# Altium schematic sheet Page-2.schdoc: CONNECTION
size 298 x 207 mm; CompanyName: InSYS; DrawnBy: NaveenKumar; Revision: 2.0; SheetNumber: 2; SheetTotal: 10; Title2: Gateway
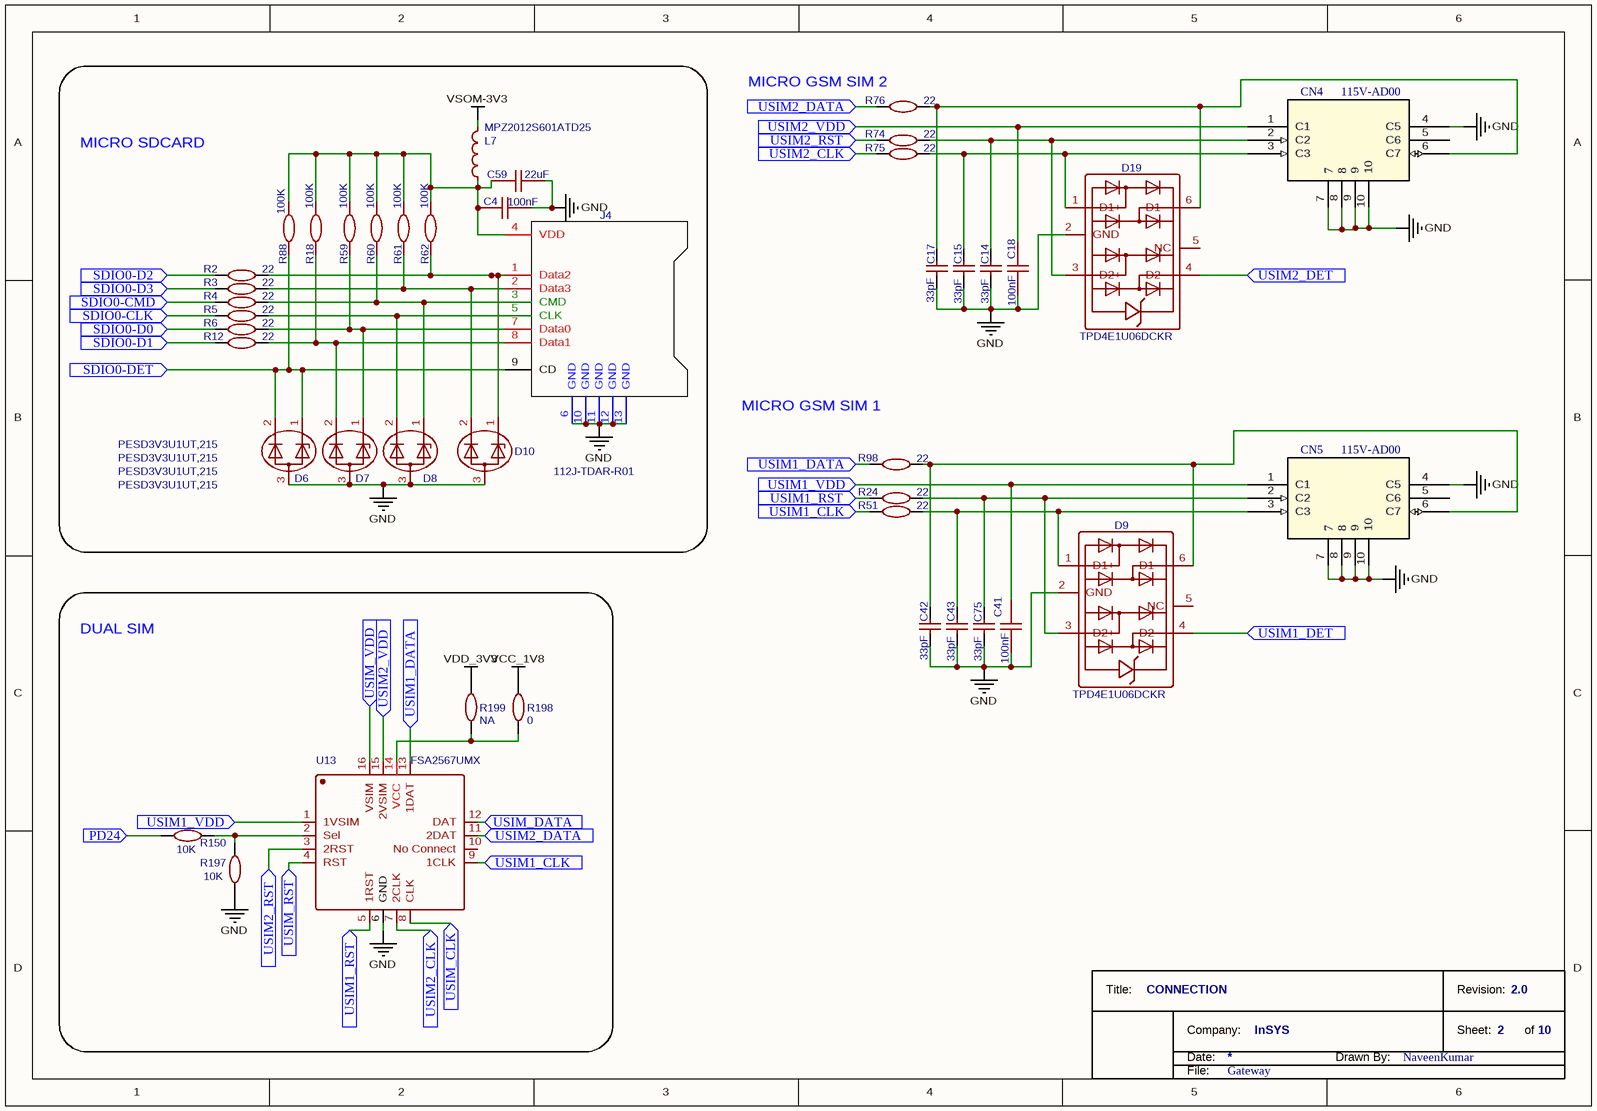
[diagram p0: Page-2.schdoc]

## Parts
*  TitleBlock_1  (value not drawn)  (graphical)
C4  100nF  [GWAY_Capacitor_0603]
C14  33pF  [GWAY_Capacitor_0603]
C15  33pF  [GWAY_Capacitor_0603]
C17  33pF  [GWAY_Capacitor_0603]
C18  100nF  [GWAY_Capacitor_0603]
C41  100nF  [GWAY_Capacitor_0603]
C42  33pF  [GWAY_Capacitor_0603]
C43  33pF  [GWAY_Capacitor_0603]
C59  22uF  [GWAY_Capacitor_0805]
C75  33pF  [GWAY_Capacitor_0603]
CN4  115V-AD00  [GWAY_115V-AD00_ATT]
CN5  115V-AD00  [GWAY_115V-AD00_ATT]
D6  PESD3V3U1UT,215  [GWAY_SOT23-3PIN]
D7  PESD3V3U1UT,215  [GWAY_SOT23-3PIN]
D8  PESD3V3U1UT,215  [GWAY_SOT23-3PIN]
D9  TPD4E1U06DCKR  [GWAY_SC70-6PIN]
D10  PESD3V3U1UT,215  [GWAY_SOT23-3PIN]
D19  TPD4E1U06DCKR  [GWAY_SC70-6PIN]
J4  112J-TDAR-R01  [GWAY_12JTDARR01]
L7  MPZ2012S601ATD25  [GWAY_FerriteeBEAD_0805_C2012X105N]
R2  22  [GWAY_Resistor_0603]
R3  22  [GWAY_Resistor_0603]
R4  22  [GWAY_Resistor_0603]
R5  22  [GWAY_Resistor_0603]
R6  22  [GWAY_Resistor_0603]
R12  22  [GWAY_Resistor_0603]
R18  100K  [GWAY_Resistor_0603]
R24  22  [GWAY_Resistor_0603]
R51  22  [GWAY_Resistor_0603]
R59  100K  [GWAY_Resistor_0603]
R60  100K  [GWAY_Resistor_0603]
R61  100K  [GWAY_Resistor_0603]
R62  100K  [GWAY_Resistor_0603]
R74  22  [GWAY_Resistor_0603]
R75  22  [GWAY_Resistor_0603]
R76  22  [GWAY_Resistor_0603]
R88  100K  [GWAY_Resistor_0603]
R98  22  [GWAY_Resistor_0603]
R150  10K  [GWAY_Resistor_0603]
R197  10K  [GWAY_Resistor_0603]
R198  0  [GWAY_Resistor_0603]
R199  NA  [GWAY_Resistor_0603]
U13  FSA2567UMX  [GWAY_FSA2567UMX]

## Blocks framed on the sheet
MICRO SDCARD: C4 C59 D6-D8 D10 J4 L7 R2-R6 R12 R18 R59-R62 R88
DUAL SIM: R150 R197-R199 U13

## Ports
PD24 (in), SDIO0-CLK (in), SDIO0-CMD (in), SDIO0-D0 (in), SDIO0-D1 (in), SDIO0-D2 (in), SDIO0-D3 (in), SDIO0-DET (in), USIM1_CLK (in), USIM1_DATA (in), USIM1_DET (in), USIM1_RST (in), USIM1_VDD (in), USIM2_CLK (in), USIM2_DATA (in), USIM2_DET (in), USIM2_RST (in), USIM2_VDD (in), USIM_CLK (in), USIM_DATA (in), USIM_RST (in), USIM_VDD (in)

## Nets
GND: C4.1 C14.1 C15.1 C17.1 C18.2 C41.2 C42.1 C43.1 C59.1 C75.1 CN4.4(C5) CN4.7 CN4.8 CN4.9 CN4.10 CN5.4(C5) CN5.7 CN5.8 CN5.9 CN5.10 D6.3 D7.3 D8.3 D9.2(GND) D10.3 D19.2(GND) J4.6(GND) J4.10(GND) J4.11(GND) J4.12(GND) J4.13(GND) R197.1 U13.6(GND)
VCC_1V8: R198.2
VDD_3V3: R199.2
VSOM-3V3: L7.2
PD24: R150.2 ; port PD24
SDIO0-CLK: R5.2 ; port SDIO0-CLK
SDIO0-CMD: R4.2 ; port SDIO0-CMD
SDIO0-D0: R6.2 ; port SDIO0-D0
SDIO0-D1: R12.2 ; port SDIO0-D1
SDIO0-D2: R2.2 ; port SDIO0-D2
SDIO0-D3: R3.2 ; port SDIO0-D3
SDIO0-DET: D6.1 D6.2 J4.9(CD) R88.2 ; port SDIO0-DET
USIM1_CLK: R51.1 U13.9(1CLK) ; port USIM1_CLK
USIM1_DATA: R98.1 U13.13(1DAT) ; port USIM1_DATA
USIM1_DET: D9.4(D2-) ; port USIM1_DET
USIM1_RST: R24.1 U13.5(1RST) ; port USIM1_RST
USIM1_VDD: C41.1 CN5.1(C1) U13.1(1VSIM) ; port USIM1_VDD
USIM2_CLK: R75.1 U13.7(2CLK) ; port USIM2_CLK
USIM2_DATA: R76.1 U13.11(2DAT) ; port USIM2_DATA
USIM2_DET: D19.4(D2-) ; port USIM2_DET
USIM2_RST: R74.1 U13.3(2RST) ; port USIM2_RST
USIM2_VDD: C18.1 CN4.1(C1) U13.15(2VSIM) ; port USIM2_VDD
USIM_CLK: U13.8(CLK) ; port USIM_CLK
USIM_DATA: U13.12(DAT) ; port USIM_DATA
USIM_RST: U13.4(RST) ; port USIM_RST
USIM_VDD: U13.16(VSIM) ; port USIM_VDD
NetC4_2: C4.2 C59.2 J4.4(VDD) L7.1 R18.1 R59.1 R60.1 R61.1 R62.1 R88.1
NetC14_2: C14.2 CN4.2(C2) D19.3(D2+) R74.2
NetC15_2: C15.2 CN4.3(C3) D19.1(D1+) R75.2
NetC17_2: C17.2 CN4.6(C7) D19.6(D1-) R76.2
NetC42_2: C42.2 CN5.6(C7) D9.6(D1-) R98.2
NetC43_2: C43.2 CN5.3(C3) D9.1(D1+) R51.2
NetC75_2: C75.2 CN5.2(C2) D9.3(D2+) R24.2
NetD7_1: D7.1 J4.7(Data0) R6.1 R59.2
NetD7_2: D7.2 J4.8(Data1) R12.1 R18.2
NetD8_1: D8.1 J4.3(CMD) R4.1 R60.2
NetD8_2: D8.2 J4.5(CLK) R5.1
NetD10_1: D10.1 J4.1(Data2) R2.1 R62.2
NetD10_2: D10.2 J4.2(Data3) R3.1 R61.2
NetR150_1: R150.1 R197.2 U13.2(Sel)
NetR198_1: R198.1 R199.1 U13.14(VCC)

Not connected (* = marked no-connect by the designer): CN4 5(C6); CN5 5(C6); D9 5(NC); D19 5(NC); U13 10(No_Connect)

## Notes on the sheet
- (near R76) MICRO GSM SIM 2
- MICRO GSM SIM 1
- (in symbol TitleBlock_1) Title:; Revision:; Company:; Sheet:; of; Date:; Drawn By:; File:

## Library data of the parts
* = TitleBlock_1: TitleBlock  No-2; TitleName: *; Company: *; Drawn By: *; File: *
C4 C18 C41 = 100nF: Manufacturer: SAMSUNG; Manufacturer Part: CL10B104KB8NNNC; nameAlias: Capacitance; Supplier: LCSC; Supplier Part: C1591; spicePre: C; spiceSymbolName: CL10B104KB8NNNC
C14 C15 C17 C42 C43 C75 = 33pF: Manufacturer Part: CL10C330JB8NNNC; Manufacturer: SAMSUNG; nameAlias: Capacitance; SMT Type: Basic; Supplier: LCSC; LCSC Assembly: Yes; Supplier Part: C1663; spicePre: C; spiceSymbolName: CL10C330JB8NNNC
C59 = 22uF: Manufacturer: SAMSUNG; Manufacturer Part: CL21A226MQQNNNE; nameAlias: Capacitance; Supplier: LCSC; Supplier Part: C5674; spicePre: C; spiceSymbolName: CL21A226MQQNNNE
CN4 CN5 = 115V-AD00: No Description Available; Mfr_Name: Attend; Copyright: Copyright (C) 2023 Ultra Librarian. All rights reserved.; Manufacturer_Part_Number: 115V-AD00; RefDes: RefDes; Type: DEV
D6-D8 D10 = PESD3V3U1UT,215: Manufacturer: Nexperia; Contributor: LCSC; Supplier: LCSC; Supplier Part: C193014; Manufacturer Part: PESD3V3U1UT,215; JLCPCB Part Class: Extended Part; spicePre: D; spiceSymbolName: PESD3V3U1UT,215
D9 D19 = TPD4E1U06DCKR: Manufacturer: Texas Instruments; Contributor: LCSC; Supplier: LCSC; Supplier Part: C194628; Manufacturer Part: TPD4E1U06DCKR; JLCPCB Part Class: Extended Part; spicePre: D; spiceSymbolName: TPD4E1U06DCKR
J4 = 112J-TDAR-R01: Contributor: Arkadiusz Karaś; spicePre: J; spiceSymbolName: 112J-TDAR-R01
L7 = MPZ2012S601ATD25: Manufacturer: TDK; Contributor: LCSC; Supplier: LCSC; Supplier Part: C81034; Manufacturer Part: MPZ2012S601ATD25; JLCPCB Part Class: Extended Part; spicePre: L; spiceSymbolName: MPZ2012S601ATD25
R2-R6 R12 R24 R51 R74-R76 R98 = 22: Manufacturer: YAGEO; Manufacturer Part: RC0603FR-0722RL; nameAlias: Resistance (Ohms); Supplier: LCSC; Supplier Part: C107701; spicePre: R; spiceSymbolName: RC0603FR-0722RL
R18 R59-R62 R88 = 100K: Manufacturer: YAGEO; Manufacturer Part: RC0603FR-07100KL; nameAlias: Resistance (Ohms); Contributor: LCSC; Supplier: LCSC; Supplier Part: C14675; spicePre: R; spiceSymbolName: RC0603FR-07100KL
R150 R197 = 10K: Manufacturer: YAGEO; Manufacturer Part: RC0603JR-0710KL; nameAlias: Resistance (Ohms); Supplier: LCSC; Supplier Part: C99198; spicePre: R; spiceSymbolName: RC0603JR-0710KL
R198 = 0: Manufacturer: YAGEO; Manufacturer Part: RC0603FR-070RL; nameAlias: Resistance (Ohms); Supplier: LCSC; Supplier Part: C100044; spicePre: R; spiceSymbolName: RC0603FR-070RL
R199 = NA: Manufacturer: YAGEO; Manufacturer Part: RC0603FR-070RL; nameAlias: Resistance (Ohms); Supplier: LCSC; Supplier Part: C100044; spicePre: R; spiceSymbolName: RC0603FR-070RL
U13 = FSA2567UMX: Manufacturer: ON Semicon; Contributor: LCSC; Supplier: LCSC; Supplier Part: C357761; Manufacturer Part: FSA2567UMX; JLCPCB Part Class: Extended Part; spicePre: U; spiceSymbolName: FSA2567UMX